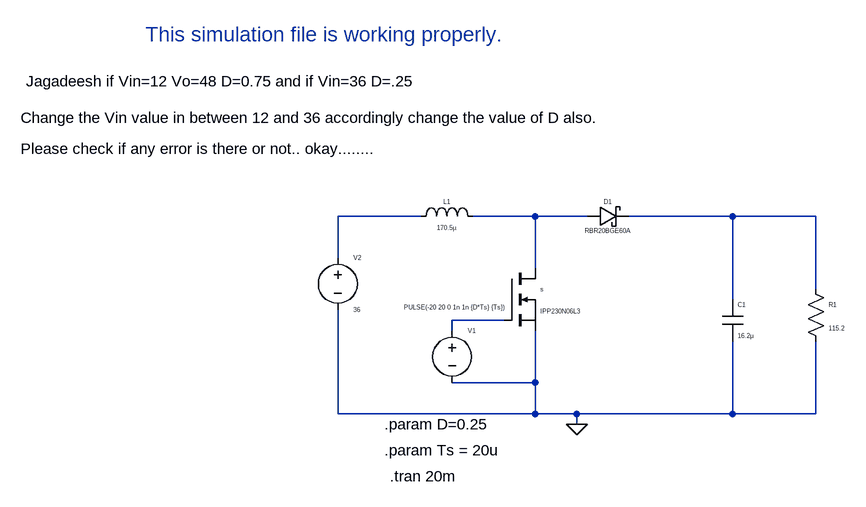
[diagram p0: schematic boost_converter.asc]
boost_converter.asc, the LTspice schematic file:
Version 4
SHEET 1 2304 680
WIRE -96 128 -224 128
WIRE 80 128 -16 128
WIRE 160 128 80 128
WIRE 384 128 224 128
WIRE 512 128 384 128
WIRE -224 192 -224 128
WIRE 80 208 80 128
WIRE 512 240 512 128
WIRE 384 256 384 128
WIRE 32 288 -48 288
WIRE -48 304 -48 288
WIRE 80 384 80 304
WIRE 80 384 -48 384
WIRE -224 432 -224 272
WIRE 80 432 80 384
WIRE 80 432 -224 432
WIRE 144 432 80 432
WIRE 384 432 384 320
WIRE 384 432 144 432
WIRE 512 432 512 320
WIRE 512 432 384 432
WIRE 144 448 144 432
FLAG 144 448 0
SYMBOL cap 368 256 R0
WINDOW 0 24 8 Left 0
WINDOW 3 24 56 Left 0
SYMATTR InstName C1
SYMATTR Value 16.2µ
SYMBOL res 496 224 R0
WINDOW 0 36 40 Left 0
WINDOW 3 36 76 Left 0
SYMATTR InstName R1
SYMATTR Value 115.2
SYMBOL ind -112 144 R270
WINDOW 0 32 56 VTop 0
WINDOW 3 5 56 VBottom 0
SYMATTR InstName L1
SYMATTR Value 170.5µ
SYMBOL nmos 32 208 R0
WINDOW 0 56 32 Left 0
WINDOW 3 56 66 Left 0
SYMATTR InstName s
SYMATTR Value IPP230N06L3
SYMBOL schottky 160 144 R270
WINDOW 0 32 32 VTop 0
WINDOW 3 0 32 VBottom 0
SYMATTR InstName D1
SYMATTR Value RBR20BGE60A
SYMATTR Description Diode
SYMATTR Type diode
SYMBOL voltage -48 288 R0
WINDOW 0 24 16 Left 0
WINDOW 3 -74 -20 Left 0
WINDOW 123 0 0 Left 0
WINDOW 39 0 0 Left 0
SYMATTR InstName V1
SYMATTR Value PULSE(-20 20 0 1n 1n {D*Ts} {Ts})
SYMBOL voltage -224 176 R0
WINDOW 0 24 16 Left 0
WINDOW 3 24 96 Left 0
WINDOW 123 0 0 Left 0
WINDOW 39 0 0 Left 0
SYMATTR InstName V2
SYMATTR Value 36
TEXT -152 448 Left 2 !.param D=0.25
TEXT -152 488 Left 2 !.param Ts = 20u
TEXT -144 528 Left 2 !.tran 20m
TEXT -704 -80 Left 2 !Jagadeesh if Vin=12 Vo=48 D=0.75 and if Vin=36 D=.25
TEXT -712 -24 Left 2 !Change the Vin value in between 12 and 36 accordingly change the value of D also.
TEXT -712 24 Left 2 !Please check if any error is there or not.. okay........
TEXT -520 -152 Left 3 ;This simulation file is working properly.

The netlist it stands for:
* boost_converter.asc
C1 N003 0 16.2µ
R1 N003 0 115.2
L1 N001 N002 170.5µ
M§s N002 N004 0 0 IPP230N06L3
D1 N002 N003 RBR20BGE60A
V1 N004 0 PULSE(-20 20 0 1n 1n {D*Ts} {Ts})
V2 N001 0 36
.model D D
.lib standard.dio
.model NMOS NMOS
.model PMOS PMOS
.lib standard.mos
.param D=0.25
.param Ts = 20u
.tran 20m
Jagadeesh if Vin=12 Vo=48 D=0.75 and if Vin=36 D=.25
Change the Vin value in between 12 and 36 accordingly change the value of D also.
Please check if any error is there or not.. okay........
* This simulation file is working properly.
.backanno
.end